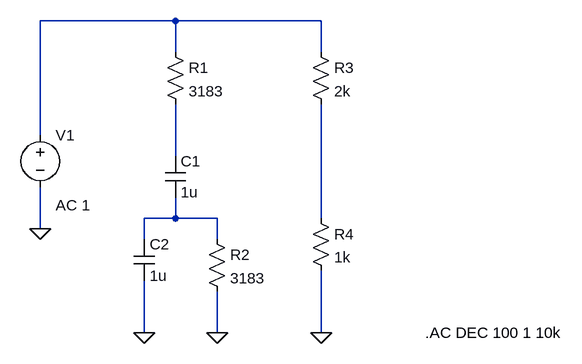
[diagram p0: schematic Wein_Robinson.asc]
Wein_Robinson.asc, the LTspice schematic file:
Version 4
SHEET 1 880 680
WIRE 112 0 -96 0
WIRE 336 0 112 0
WIRE 112 48 112 0
WIRE 336 48 336 0
WIRE -96 176 -96 0
WIRE 112 208 112 128
WIRE 112 304 112 272
WIRE 112 304 64 304
WIRE 176 304 112 304
WIRE 336 304 336 128
WIRE -96 320 -96 256
WIRE 64 336 64 304
WIRE 176 336 176 304
WIRE 64 480 64 400
WIRE 176 480 176 416
WIRE 336 480 336 384
FLAG 64 480 0
FLAG 176 480 0
FLAG 336 480 0
FLAG -96 320 0
SYMBOL res 96 32 R0
SYMATTR InstName R1
SYMATTR Value 3183
SYMBOL cap 96 208 R0
SYMATTR InstName C1
SYMATTR Value 1u
SYMBOL cap 48 336 R0
SYMATTR InstName C2
SYMATTR Value 1u
SYMBOL res 160 320 R0
SYMATTR InstName R2
SYMATTR Value 3183
SYMBOL res 320 32 R0
SYMATTR InstName R3
SYMATTR Value 2k
SYMBOL res 320 288 R0
SYMATTR InstName R4
SYMATTR Value 1k
SYMBOL voltage -96 160 R0
WINDOW 123 24 124 Left 2
WINDOW 39 0 0 Left 2
SYMATTR Value2 AC 1
SYMATTR InstName V1
SYMATTR Value ""
TEXT 496 480 Left 2 !.AC DEC 100 1 10k

The netlist it stands for:
* Wein_Robinson.asc
R1 N001 N002 3183
C1 N002 N003 1u
C2 N003 0 1u
R2 N003 0 3183
R3 N001 N004 2k
R4 N004 0 1k
V1 N001 0 AC 1
.AC DEC 100 1 10k
.backanno
.end